# EAGLE design Goldfish-Voiceboard-based on fishr3 (EAGLE 6.5.0)
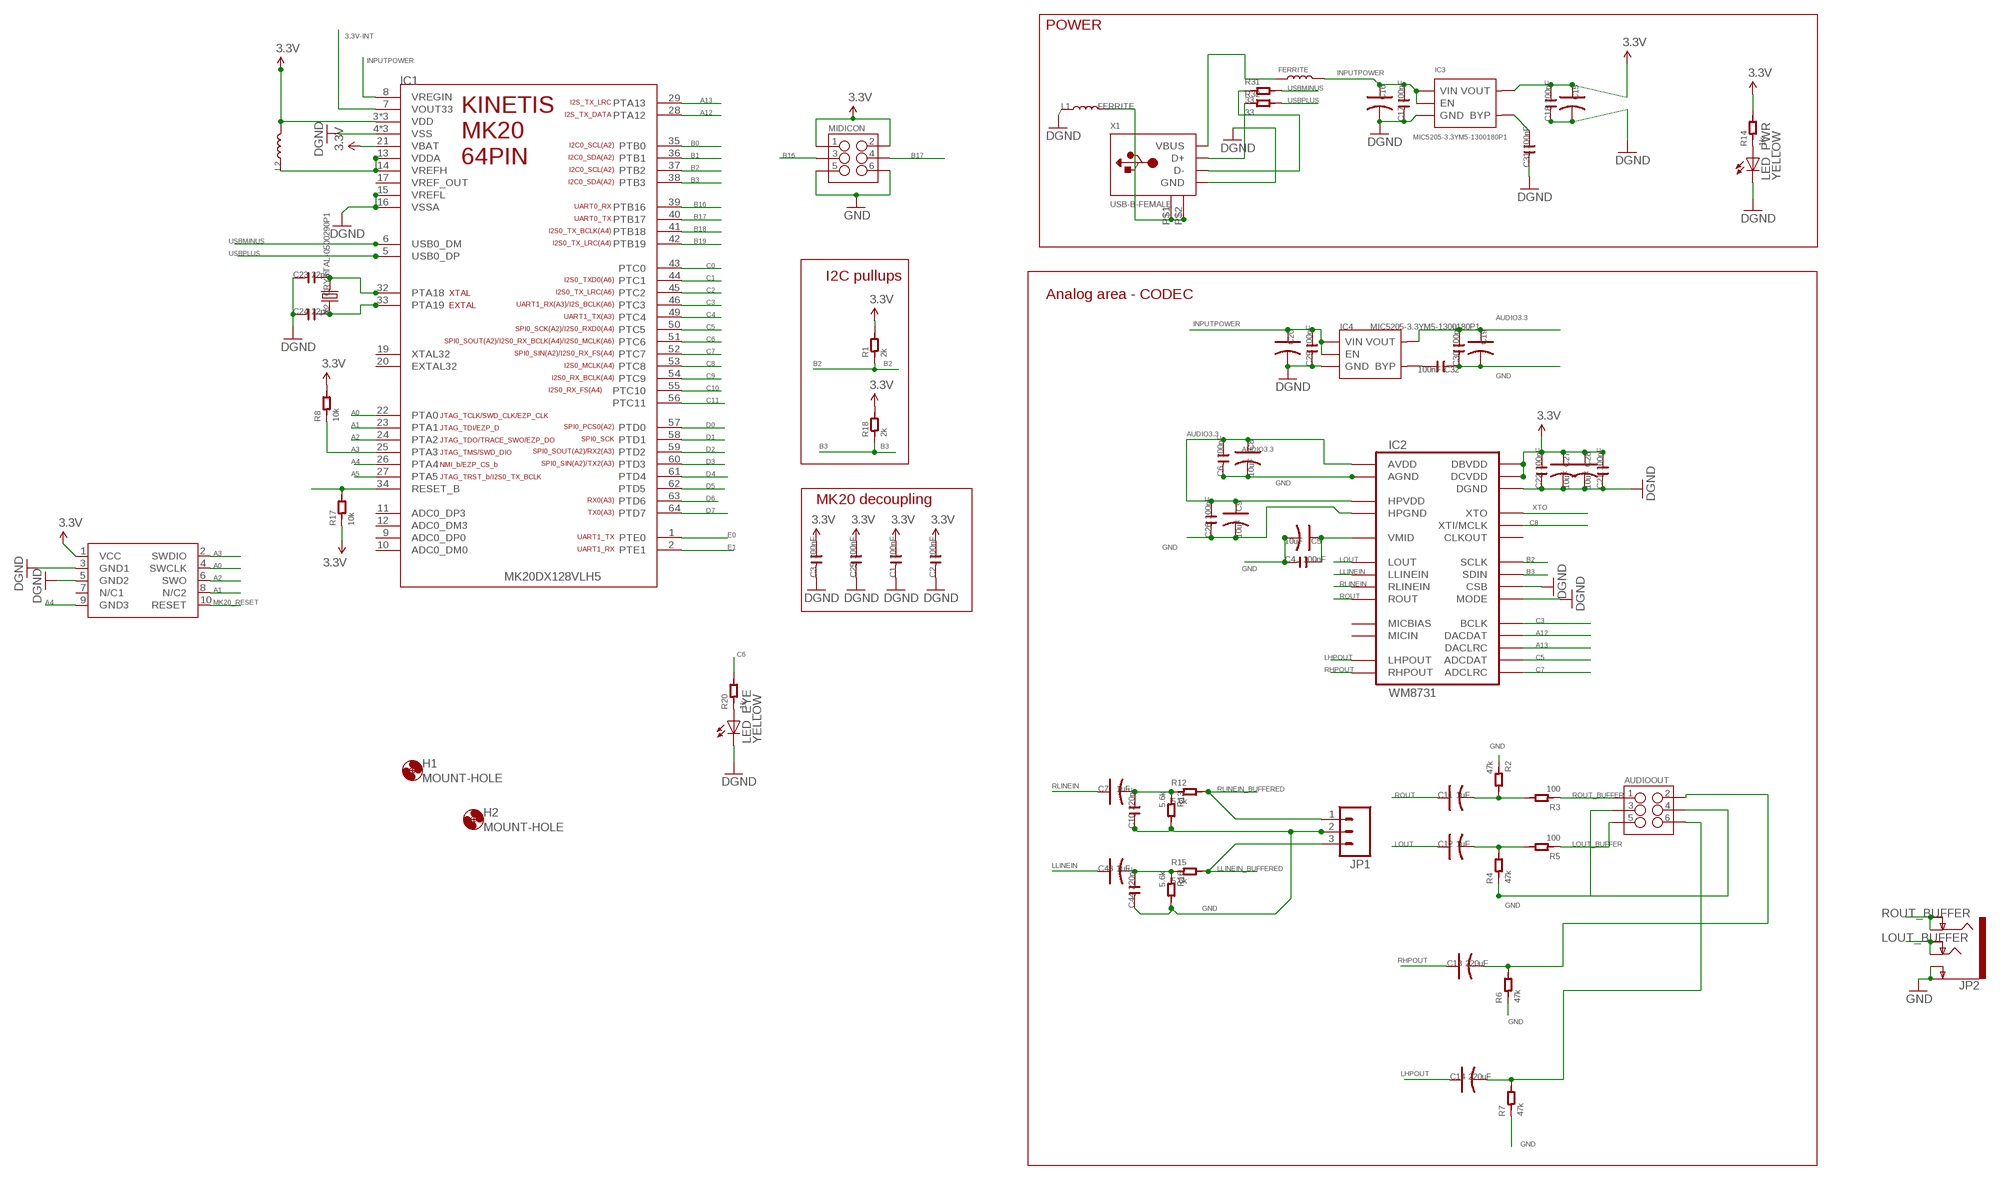
[diagram p0: schematic, sheet 1]

## Parts
AUDIOOUT  M03X2SMT  [2X3_SMT_POSTS]
C1  100nF  C-0603  [C0603]
C2  100nF  C-0603  [C0603]
C3  100nF  C-0603  [C0603]
C4  100nF  C-0603  [C0603]
C5  10uF  C-POLAR-A  [AVX-A]
C6  100nF  C-0603  [C0603]
C7  1uF  C-POLAR-A  [AVX-A]
C8  10uF  C-POLAR-A  [AVX-A]
C9  10uF  C-POLAR-A  [AVX-A]
C10  220nF  C-0603  [C0603]
C11  1uF  C-POLAR-A  [AVX-A]
C12  1uF  C-POLAR-A  [AVX-A]
C13  220uF  C-POLAR-B  [AVX-B]
C14  220uF  C-POLAR-B  [AVX-B]
C15  C-POLAR-A  [AVX-A]
C16  C-POLAR-A  [AVX-A]
C17  100nF  C-0603  [C0603]
C18  100nF  C-0603  [C0603]
C19  C-POLAR-A  [AVX-A]
C20  C-POLAR-A  [AVX-A]
C21  100nF  C-0603  [C0603]
C22  100nF  C-0603  [C0603]
C23  22pF  C-0603  [C0603]
C24  22pF  C-0603  [C0603]
C25  100nF  C-0603  [C0603]
C26  100nF  C-0603  [C0603]
C27  10uF  C-POLAR-A  [AVX-A]
C28  10uF  C-POLAR-A  [AVX-A]
C29  100nF  C-0603  [C0603]
C30  100nF  C-0603  [C0603]
C31  100nF  C-0603  [C0603]
C32  100nF  C-0603  [C0603]
C43  1uF  C-POLAR-A  [AVX-A]
C44  220nF  C-0603  [C0603]
H1  MOUNT-HOLE  [3.2-NOMARKINGS-SMALLSAFEZONE]
H2  MOUNT-HOLE  [3.2-NOMARKINGS-SMALLSAFEZONE]
IC1  MK20DX128VLH5  [MK20DX128VLH5]
IC2  WM8731  [28-SSOP]
IC3  MIC5205-3.3YM5-1300180P1  [SOT23-5]
IC4  MIC5205-3.3YM5-1300180P1  [SOT23-5]
JP1  M03PTH  [1X03]
JP2  AUDIO-JACK4-.25-HORIZ-TRS  [AUDIO-JACK-.25-INCH-HORIZ-PTH]
L1  FERRITE  L-0603  [L0603]
L2  L-0603  [L0603]
L4  FERRITE  L-0603  [L0603]
LED_EYE  YELLOW  LEDCHIP-LED0603  [CHIP-LED0603]
LED_PWR  YELLOW  LEDCHIP-LED0603  [CHIP-LED0603]
MIDICON  M03X2SMT  [2X3_SMT_POSTS]
R1  2k  R-0603  [R0603]
R2  47k  R-0603  [R0603]
R3  100  R-0603  [R0603]
R4  47k  R-0603  [R0603]
R5  100  R-0603  [R0603]
R6  47k  R-0603  [R0603]
R7  47k  R-0603  [R0603]
R8  10k  R-0603  [R0603]
R12  5.6k  R-0603  [R0603]
R13  5.6k  R-0603  [R0603]
R14  1k  R-0603  [R0603]
R15  5.6k  R-0603  [R0603]
R16  5.6k  R-0603  [R0603]
R17  10k  R-0603  [R0603]
R18  2k  R-0603  [R0603]
R20  1k  R-0603  [R0603]
R31  33  R-0603  [R0603]
R32  33  R-0603  [R0603]
SWD1  CORTEX_SWD  [M50-3600542]
X1  USB-B-FEMALE  [FCI61729]
X2  CRYSTAL-0500290P1  [2P-SMD-5.0X3.2]

## Nets
3.3V: C1.2 C2.2 C3.2 C15.+ C18.2 C21.2 C22.2 C25.2 C27.+ C28.+ IC1.3(VDD) IC1.21(VBAT) IC1.30(VDD) IC1.48(VDD) IC2.P$1(DBVDD) IC2.P$27(DCVDD) IC3.5(VOUT) L2.2 MIDICON.1 MIDICON.2 R1.2 R8.2 R14.2 R17.1 R18.2 SWD1.1(VCC)
3.3V-INT: IC1.7(VOUT33)
A0: IC1.22(PTA0) SWD1.4(SWCLK)
A1: IC1.23(PTA1) SWD1.8(N/C2)
A2: IC1.24(PTA2) SWD1.6(SWO)
A3: IC1.25(PTA3) R8.1 SWD1.2(SWDIO)
A4: IC1.26(PTA4) SWD1.9(GND3)
A5: IC1.27(PTA5)
A12: IC1.28(PTA12) IC2.P$4(DACDAT)
A13: IC1.29(PTA13) IC2.P$5(DACLRC)
AUDIO3.3 [GND]: C6.2 C8.+ C9.+ C19.+ C26.2 C30.2 IC2.P$8(HPVDD) IC2.P$14(AVDD) IC4.5(VOUT)
B0: IC1.35(PTB0)
B1: IC1.36(PTB1)
B2: IC1.37(PTB2) IC2.P$24(SCLK) R1.1
B3: IC1.38(PTB3) IC2.P$23(SDIN) R18.1
B16: IC1.39(PTB16) MIDICON.3
B17: IC1.40(PTB17) MIDICON.4
B18: IC1.41(PTB18)
B19: IC1.42(PTB19)
C0: IC1.43(PTC0)
C1: IC1.44(PTC1)
C2: IC1.45(PTC2)
C3: IC1.46(PTC3) IC2.P$3(BCLK)
C4: IC1.49(PTC4)
C5: IC1.50(PTC5) IC2.P$6(ADCDAT)
C6: IC1.51(PTC6) R20.2
C7: IC1.52(PTC7) IC2.P$7(ADCLRC)
C8: IC1.53(PTC8) IC2.P$25(XTI/MCLK)
C9: IC1.54(PTC9)
C10: IC1.55(PTC10)
C11: IC1.56(PTC11)
D0: IC1.57(PTD0)
D1: IC1.58(PTD1)
D2: IC1.59(PTD2)
D3: IC1.60(PTD3)
D4: IC1.61(PTD4)
D5: IC1.62(PTD5)
D6: IC1.63(PTD6)
D7: IC1.64(PTD7)
E0: IC1.1(PTE0)
E1: IC1.2(PTE1)
GND: AUDIOOUT.3 AUDIOOUT.4 C1.1 C2.1 C3.1 C4.1 C5.- C6.1 C8.- C9.- C10.1 C15.- C16.- C17.1 C18.1 C19.- C20.- C21.1 C22.1 C23.1 C24.1 C25.1 C26.1 C27.- C28.- C29.1 C30.1 C31.1 C32.1 C44.1 IC1.4(VSS) IC1.15(VREFL) IC1.16(VSSA) IC1.31(VSS) IC1.47(VSS) IC2.P$11(HPGND) IC2.P$15(AGND) IC2.P$21(MODE) IC2.P$22(CSB) IC2.P$28(DGND) IC3.2(GND) IC4.2(GND) JP1.2 JP2.P$2(EARTH) JP2.P$3(EARTH-NORM) L1.1 LED_EYE.C LED_PWR.C MIDICON.5 MIDICON.6 R2.1 R4.1 R6.1 R7.1 R13.2 R16.2 SWD1.3(GND1) SWD1.5(GND2) X1.4(GND) ; supply symbol labelled DGND
INPUTPOWER: C16.+ C17.2 C20.+ C29.2 IC1.8(VREGIN) IC3.1(VIN) IC3.3(EN) IC4.1(VIN) IC4.3(EN) L4.2
LHPOUT [MEDIUMAUDIO]: C14.+ IC2.P$9(LHPOUT)
LHPOUT_BUFFER [MEDIUMAUDIO]: AUDIOOUT.6 C14.- R7.2
LLINEIN [MEDIUMAUDIO]: C43.+ IC2.P$20(LLINEIN)
LLINEIN_BUFFERED [MEDIUMAUDIO]: JP1.3 R15.2
LOUT [MEDIUMAUDIO]: C12.+ IC2.P$12(LOUT)
LOUT_BUFFER [MEDIUMAUDIO]: AUDIOOUT.5 JP2.P$6(TIP) JP2.P$7(TIP-NORM) R5.1
MK20_RESET: IC1.34(RESET_B) R17.2 SWD1.10(RESET)
N$1: L4.1 X1.1(VBUS)
N$2: LED_PWR.A R14.1
N$3: L1.2 X1.P$1(GND1) X1.P$2(GND2)
N$9: C23.2 IC1.32(PTA18) X2.2
N$10: C24.2 IC1.33(PTA19) X2.1
N$12: C31.2 IC3.4(BYP)
N$13: C32.2 IC4.4(BYP)
N$17: LED_EYE.A R20.1
N$33: IC1.13(VDDA) IC1.14(VREFH) L2.1
N$41 [MEDIUMAUDIO]: C11.- R2.2 R3.2
N$43 [MEDIUMAUDIO]: C43.- C44.2 R15.1 R16.1
N$44 [MEDIUMAUDIO]: C7.- C10.2 R12.1 R13.1
N$46 [MEDIUMAUDIO]: C12.- R4.2 R5.2
N$65: C4.2 C5.+ IC2.P$16(VMID)
RHPOUT [MEDIUMAUDIO]: C13.+ IC2.P$10(RHPOUT)
RHPOUT_BUFFER [MEDIUMAUDIO]: AUDIOOUT.2 C13.- R6.2
RLINEIN [MEDIUMAUDIO]: C7.+ IC2.P$19(RLINEIN)
RLINEIN_BUFFERED [MEDIUMAUDIO]: JP1.1 R12.2
ROUT [MEDIUMAUDIO]: C11.+ IC2.P$13(ROUT)
ROUT_BUFFER [MEDIUMAUDIO]: AUDIOOUT.1 JP2.P$4(RING) JP2.P$5(RING-NORM) R3.1
USB_N: R32.1 X1.3(D+)
USB_P: R31.1 X1.2(D-)
USBMINUS: IC1.6(USB0_DM) R31.2
USBPLUS: IC1.5(USB0_DP) R32.2
XTO: IC2.P$26(XTO)
Unconnected: IC1.9(ADC0_DP0) IC1.10(ADC0_DM0) IC1.11(ADC0_DP3) IC1.12(ADC0_DM3) IC1.17(VREF_OUT) IC1.19(XTAL32) IC1.20(EXTAL32) IC2.P$2(CLKOUT) IC2.P$17(MICBIAS) IC2.P$18(MICIN) SWD1.7(N/C1)

## Notes on the sheet
- POWER
- I2C pullups
- Analog area - CODEC
- MK20 decoupling

## Library data of the parts
AUDIOOUT MIDICON = zephod-components:M03X2: 2x3 .1" header. Shrouded, with keying- CONN-10681 SMT- CONN-11415 Pogo pins- HW-11044; PROD_ID: CONN-11415
C1-C4 C6 C10 C17 C18 C21-C26 C29-C32 C44 = OPL Eagle Library:C*
C5 C7-C9 C11-C16 C19 C20 C27 C28 C43 = OPL Eagle Library:C-POLAR*
H1 H2 = zephod-components:MOUNT-HOLE: MOUNTING HOLE with drill center marker
IC1 = zephod-components:MK20DX128VLH5: Teensy 3.0 Processing Unit - MK20DX128VLH5 ARM Cortex M0 Datasheet: http://cache.freescale.com/files/32bit/doc/data_sheet/K20P64M50SF0.pdf
IC2 = microdecv1:WM8731
IC3 IC4 = OPL Eagle Library:MIC5205-3.3YM5: The MIC5205 is an efficient linear voltage regulator with ultra-low-noise output, very low dropout voltage (typically 17mV at light loads and 165mV at 150mA), and very low ground current (600µA at 100mA output). The MIC5205 offers better than 1% initial accuracy. datasheet here: http://www.micrel.com/product-info/prod/5205.shtml
JP1 = SparkFun-Connectors:M03: Header 3 Standard 3-pin 0.1" header. Use with straight break away headers (SKU : PRT-00116), right angle break away headers (PRT-00553), swiss pins (PRT-00743), machine pins (PRT-00117), and female headers (PRT-00115). Molex polarized connector foot print use with SKU : PRT-08232 with associated crimp pins and housings.
JP2 = SparkFun-Connectors:AUDIO-JACK4-.25-HORIZ-TRS: 1/4" TRS jack, horizontal Production SKU: COM-11144 Footprint unproven - datasheet and part seem to be slightly different; PROD_ID: COM-11144
L1 L2 L4 = OPL Eagle Library:L*
LED_EYE LED_PWR = adafruit:LED: LED OSRAM: - CHIPLED LG R971, LG N971, LY N971, LG Q971, LY Q971, LO R971, LY R971 LH N974, LH R974 LS Q976, LO Q976, LY Q976 LO Q996 - Hyper CHIPLED LW Q18S LB Q993, LB Q99A, LB R99A - SideLED LS A670, LO A670, LY A670, LG A670, LP A670 LB A673, LV A673, LT A673, LW A673 LH A674 LY A675 LS A676, LA A676, LO A676, LY A676, LW A676 LS A679, LY A679, LG A679 - Hyper Micro SIDELED® LS Y876, LA Y876, LO Y876, LY Y876 LT Y87S - SmartLED LW L88C, LW L88S LB L89C, LB L89S, LG L890 LS L89K, LO L89K, LY L89K LS L896, LA L896, LO L896, LY L896 - TOPLED LS T670, LO T670, LY T670, LG T670, LP T670 LSG T670, LSP T670, LSY T670, LOP T670, LYG T670 LG T671, LOG T671, LSG T671 LB T673, LV T673, LT T673, LW T673 LH T674 LS T676, LA T676, LO T676, LY T676, LB T676, LH T676, LSB T676, LW T676 LB T67C, LV T67C, LT T67C, LS T67K, LO T67K, LY T67K, LW E67C LS E67B, LA E67B, LO E67B, LY E67B, LB E67C, LV E67C, LT E67C LW T67C LS T679, LY T679, LG T679 LS T770, LO T770, LY T770, LG T770, LP T770 LB T773, LV T773, LT T773, LW T773 LH T774 LS E675, LA E675, LY E675, LS T675 LS T776, LA T776, LO T776, LY T776, LB T776 LHGB T686 LT T68C, LB T68C - Hyper Mini TOPLED® LB M676 - Mini TOPLED Santana® LG M470 LS M47K, LO M47K, LY M47K Source: http://www.osram.convergy.de/
R1 R18 = OPL:R*
R2-R8 R12-R17 R20 R31 R32 = OPL Eagle Library:R*
SWD1 = carrilib with jtags:CORTEX_SWD: .05" Cortex M Connector in SWD mode Manufacturer: Generic Part Number: Cortex M SWD Notes: I use Harwin M50-3600542 connectors
X1 = ld-components:USB-B-FEMALE: USB type B receptacle FCI 61729-59796
X2 = OPL Eagle Library:CRYSTAL*

## Net classes
0 default: width 0.178 mm, drill 0.102 mm
1 GND: width 0.229 mm
2 BIGAUDIO: width 1.016 mm
3 MEDIUMAUDIO: width 0.381 mm

## Board
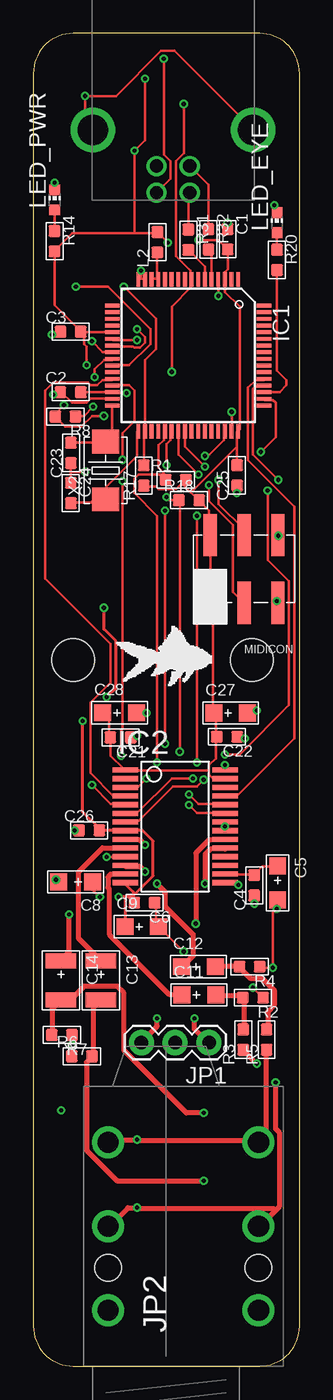
[diagram p1: board, top side]
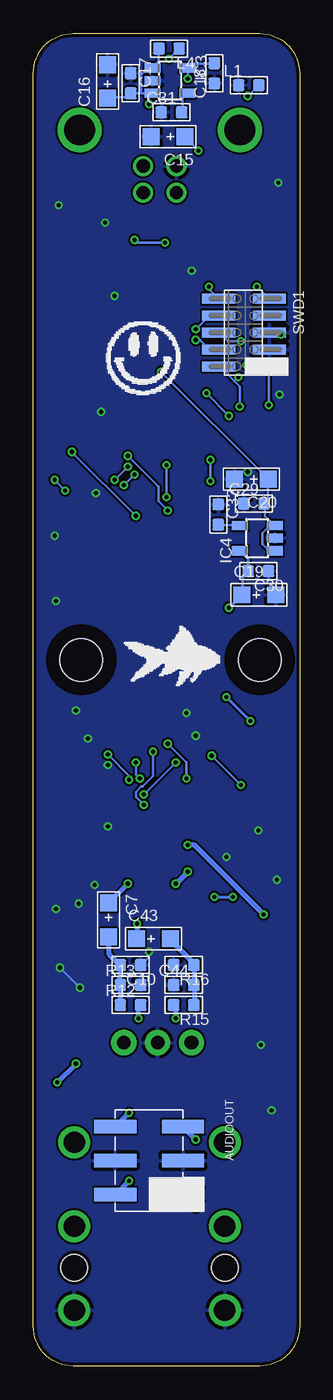
[diagram p2: board, bottom side, seen from below]

Size 20 x 100 mm. Coordinates in mm from the lower left corner, seen from the top.
Outline: 20,3 20,97 arc90 17,100 3,100 arc90 0,97 0,3 arc90 3,0 17,0 arc90 20,3
Copper layers (1*16): Top 0.035mm / dielectric 1.5mm / Bottom 0.035mm
Design rules "ITEADstudio_DRC": minimum track width 6mil, minimum drill 12mil, track to track 6mil, track to pad 6mil, pad to pad 6mil, via to via 6mil, smd to smd 0mil, copper to edge 10mil, drill to drill 10mil, minimum pad ring 10mil, minimum via ring 6mil, stop-mask expansion 2mil, vias tented up to drill 100mil, thermal gap 10mil
tRestrict: area 41.9,18.8 to 48.5,18.9

### Footprints (pad centres in the part's own frame; a part is rotated, then mirrored left to right if it is on the bottom)
2X3_SMT_POSTS = smd 1 x 3.17: 1 -2.54,-2.54; 2 -2.54,2.54; 3 0,-2.54; 4 0,2.54; 5 2.54,-2.54; 6 2.54,2.54
C0603 = smd 0.889 x 0.889: 1 -0.762,0; 2 0.762,0
AVX-A = smd 1.27 x 1.27: + -1.27,0; - 1.27,0
AVX-B = smd 1.143 x 2.286: + -1.46,0; - 1.46,0
3.2-NOMARKINGS-SMALLSAFEZONE = hole 3.2: 0,0
MK20DX128VLH5 = smd 1.1 x 0.285: 1 -5.605,3.385; 2 -5.605,2.885; 3 -5.605,2.385; 4 -5.605,1.885; 5 -5.605,1.385; 6 -5.605,0.885; 7 -5.605,0.385; 8 -5.605,-0.115; 9 -5.605,-0.615; 10 -5.605,-1.115; 11 -5.605,-1.615; 12 -5.605,-2.115; 13 -5.605,-2.615; 14 -5.605,-3.115; 15 -5.605,-3.615; 16 -5.605,-4.115; 33 5.795,-4.115; 34 5.795,-3.615; 35 5.795,-3.115; 36 5.795,-2.615; 37 5.795,-2.115; 38 5.795,-1.615; 39 5.795,-1.115; 40 5.795,-0.615; 41 5.795,-0.115; 42 5.795,0.385; 43 5.795,0.885; 44 5.795,1.385; 45 5.795,1.885; 46 5.795,2.385; 47 5.795,2.885; 48 5.795,3.385 | smd 0.285 x 1.1: 17 -3.655,-6.065; 18 -3.155,-6.065; 19 -2.655,-6.065; 20 -2.155,-6.065; 21 -1.655,-6.065; 22 -1.155,-6.065; 23 -0.655,-6.065; 24 -0.155,-6.065; 25 0.345,-6.065; 26 0.845,-6.065; 27 1.345,-6.065; 28 1.845,-6.065; 29 2.345,-6.065; 30 2.845,-6.065; 31 3.345,-6.065; 32 3.845,-6.065; 49 3.845,5.335; 50 3.345,5.335; 51 2.845,5.335; 52 2.345,5.335; 53 1.845,5.335; 54 1.345,5.335; 55 0.845,5.335; 56 0.345,5.335; 57 -0.155,5.335; 58 -0.655,5.335; 59 -1.155,5.335; 60 -1.655,5.335; 61 -2.155,5.335; 62 -2.655,5.335; 63 -3.155,5.335; 64 -3.655,5.335
28-SSOP = smd 0.381 x 1.905: P$1 -4.55,-3.752; P$2 -3.9,-3.752; P$3 -3.25,-3.752; P$4 -2.6,-3.752; P$5 -1.95,-3.752; P$6 -1.3,-3.752; P$7 -0.65,-3.752; P$8 0,-3.752; P$9 0.65,-3.752; P$10 1.3,-3.752; P$11 1.95,-3.752; P$12 2.6,-3.752; P$13 3.25,-3.752; P$14 3.9,-3.752; P$15 3.9,3.752; P$16 3.25,3.752; P$17 2.6,3.752; P$18 1.95,3.752; P$19 1.3,3.752; P$20 0.65,3.752; P$21 0,3.752; P$22 -0.65,3.752; P$23 -1.3,3.752; P$24 -1.95,3.752; P$25 -2.6,3.752; P$26 -3.25,3.752; P$27 -3.9,3.752; P$28 -4.55,3.752
SOT23-5 = smd 0.69 x 1.2: 1 -0.95,-1.3; 2 0,-1.3; 3 0.95,-1.3; 4 0.95,1.3; 5 -0.95,1.3
1X03 = drill 1.016 pad 1.88: 1 0,0; 2 2.54,0; 3 5.08,0
AUDIO-JACK-.25-INCH-HORIZ-PTH = drill 1.6: P$2 4.2,-6.92; P$3 4.2,4.38; P$4 10.5,-6.92; P$5 10.5,4.38; P$6 16.8,-6.92; P$7 16.8,4.38 | hole 2: 7.4,4.38; 7.4,-6.92
L0603 = smd 0.889 x 0.889: 1 -0.762,0; 2 0.762,0
CHIP-LED0603 = smd 0.8 x 0.8: A 0,-0.75; C 0,0.75
R0603 = smd 0.889 x 0.889: 1 -0.762,0; 2 0.762,0
M50-3600542 = smd 0.75 x 2.5: 1 -2.54,-1.81; 2 -2.54,2; 3 -1.27,-1.81; 4 -1.27,2; 5 0,-1.81; 6 0,2; 7 1.27,-1.81; 8 1.27,2; 9 2.54,-1.81; 10 2.54,2
FCI61729 = drill 1: 1 1.25,4.71; 2 -1.25,4.71; 3 -1.25,2.71; 4 1.25,2.71 | drill 2.3: P$1 -6.02,0; P$2 6.02,0
2P-SMD-5.0X3.2 = smd 1.778 x 2.032: 1 -2.159,0; 2 2.159,0

### Placement (x,y rotation side)
AUDIOOUT  11.3,15.43 90 bottom
C1  14.6,84.55 270 top
C2  2.8,73.08 0 top
C3  2.81,77.61 0 top
C4  16.6,36.08 90 top
C5  18.35,36.25 270 top
C6  8.35,34.77 180 top
C7  14.35,33.48 270 bottom
C8  3.17,36.33 180 top
C9  8.15,32.98 0 top
C10  12.7,30.1 180 bottom
C11  12.45,27.85 0 top
C12  12.4,29.98 0 top
C13  5.08,28.95 270 top
C14  2.08,28.95 270 top
C15  9.88,92.25 180 bottom
C16  14.43,96.39 90 bottom
C17  12.68,96.25 270 bottom
C18  6.4,97 90 bottom
C19  3.05,57.88 0 bottom
C20  3.62,66.55 180 bottom
C21  6.55,47.17 180 top
C22  14.55,47.23 180 top
C23  2.83,68.52 90 top
C24  2.82,65.51 270 top
C25  15.31,66.83 90 top
C26  4.2,40.2 0 top
C27  14.82,49 0 top
C28  6.47,49.02 0 top
C29  3.42,64.72 0 bottom
C30  3.1,59.65 180 bottom
C31  9.62,94.08 0 bottom
C32  6.1,63.9 270 bottom
C43  10.97,32.08 0 bottom
C44  8.7,28.6 0 bottom
H1  16.4,53 0 top
H2  3,53 0 top
IC1  12,75.92 270 top
IC2  10.65,40.17 270 top
IC3  9.73,96.45 270 bottom
IC4  3.17,62.12 90 bottom
JP1  13.2,24.27 180 top
JP2  10,0 90 top
L1  3.81,96.11 0 bottom
L2  9.32,84.33 90 top
L4  9.8,98.85 180 bottom
LED_EYE  18.3,85.8 0 top
LED_PWR  1.6,87.5 0 top
MIDICON  15.82,59.83 0 top
R1  10.7,66.5 0 top
R2  16.5,27.65 180 top
R3  15.78,24.5 90 top
R4  16.25,29.98 180 top
R5  17.52,24.5 90 top
R6  3.65,23.25 0 top
R7  2.15,24.85 180 top
R8  2.41,71.26 180 top
R12  12.7,27.1 0 bottom
R13  12.7,28.6 0 bottom
R14  1.6,84.4 270 top
R15  8.7,27.1 180 bottom
R16  8.7,30.1 180 bottom
R17  8.3,66.83 90 top
R18  11.7,64.97 0 top
R20  18.3,83 270 top
R31  11.64,84.52 270 top
R32  13.16,84.54 270 top
SWD1  4.08,77.55 90 bottom
U$1  [FISH_SMALL]  11.6,53.1 0 top
U$2  [ACIDSMILE]  11.7,75.7 0 bottom
U$3  [FISH_SMALL]  7.8,53.1 0 bottom
X1  10.5,92.75 180 top
X2  5.43,67.2 90 top

### Tracks (layer width: path | path; a pad name or v marks a point on that pad's centre or on a via)
3.3V  (via drill 0.3)
  Top 0.178: C2.2 3.6,73.1 5.9,73.1 IC1.30 6,73 v7,73 | v2.3,72.1 1.7,71.5 1.7,71.3 R8.2 1.7,71.2 2.4,70.5 3.6,70.5 4.4,71.3 v5.3,71.3 | 3.8,77.6 5.9,77.6 IC1.21 | 3.8,77.6 3.6,77.6 C3.2 | C3.2 3.5,77.7 1.6,79.6 R14.2 1.6,83.7 2.9,85 7.6,85 | 7.6,85 9.3,85 L2.2 9.4,85 v10.1,84.3 | 7.6,85 v7.6,91.2 8.4,92 v8.4,96.6 | v4,75.1 4,76.5 3.8,76.7 3.8,77.6 | 3.8,77.6 C3.2 | 13.2,44.7 13.2,44.4 13.5,44.1 14.4,44.1 IC2.P$27 | 13.2,44.7 13.2,45.1 13.7,45.6 13.7,47.2 C22.2 13.7,47.3 13.7,48.9 13.6,49 C27.+ 13.5,49 13.5,57 13.3,57.2 MIDICON.1 13.3,62.3 MIDICON.2 13.2,62.4 13.2,64.2 12.5,64.9 R18.2 12.4,65 11.85,65.55 | C28.+ 5.3,49 5.7,48.6 5.7,47.2 C21.2 5.8,47.1 5.8,45.8 6.8,44.8 IC2.P$1 6.9,44.7 13.2,44.7 | R17.1 8.3,66 9.2,66 9.4,65.8 10.7,65.8 11.4,66.5 R1.2 11.2,66.2 11.85,65.55 | 15.3,69 15.3,70.1 IC1.48 15.4,70.2 15.5,70.3 15.5,79.5 14.4,80.6 14.4,81.5 IC1.3 14.4,81.6 14.4,82.1 14.6,82.3 C1.2 13.9,84.5 v12.4,84.5 | 15.3,69 C25.2 | 15.3,69 11.85,65.55
  Bottom 0.178: v2.3,72.1 2.3,75 SWD1.1 2.3,75.1 v4,75.1 | v5.3,71.3 v7,73 | C18.2 6.5,97.7 8.2,97.7 8.4,97.5 IC3.5 8.4,97.4 v8.4,96.6 | v7.6,91.2 8.6,92.2 C15.+ | v10.1,84.3 12.2,84.3 v12.4,84.5
A0  (via drill 0.3)
  Top 0.178: v7.8,77 6,77 IC1.22
  Bottom 0.178: v7.8,77 7.5,77 6.8,76.3 6.1,76.3 SWD1.4
A1  (via drill 0.3)
  Top 0.178: v7.8,77.8 8.4,77.2 8.4,76.8 8,76.4 7.6,76.4 7.5,76.5 6,76.5 IC1.23
  Bottom 0.178: v7.8,77.8 6.8,78.8 6.1,78.8 SWD1.8
A2  (via drill 0.3)
  Top 0.178: v4.4,76.9 5.2,76.1 5.9,76.1 IC1.24
  Bottom 0.178: v4.4,76.9 5.4,76.9 6,77.5 SWD1.6
A3  (via drill 0.3)
  Top 0.178: v4.5,72 3.8,71.3 3.2,71.3 R8.1 | v4.6,74.2 4.6,74.8 5.3,75.5 5.9,75.5 IC1.25
  Bottom 0.178: v4.5,72 4.5,73.5 4.9,73.9 | 4.9,73.9 6,75 SWD1.2 | 4.9,73.9 v4.6,74.2
A4  (via drill 0.3)
  Top 0.178: v3.2,81 5.6,81 8.8,77.8 8.8,76.7 7.2,75.1 6,75.1 IC1.26
  Bottom 0.178: v3.2,81 2.3,80.1 SWD1.9
A12
  Top 0.178: IC1.28 5.9,74 5.2,74 4.8,73.6 4.3,73.6 4.1,73.8 1.5,73.8 0.9,73.2 0.9,59.1 5.8,54.2 5.8,51.3 4.3,49.8 4.3,44.5 6,42.8 6.8,42.8 IC2.P$4
A13  (via drill 0.3)
  Top 0.178: v6.7,68 6.7,70 7.6,70.9 7.6,73.2 7.2,73.6 6,73.6 IC1.29 | v6.7,66.4 6.7,47.8 6.6,47.7 v6.6,45.8 | v4.4,43.6 5.8,42.2 6.8,42.2 IC2.P$5
  Bottom 0.178: v6.7,66.4 v6.7,68 | v4.4,43.6 v6.6,45.8
AUDIO3.3  (via drill 0.3)
  Top 0.229: 7.5,35.4 7.5,35.6 6.9,36.2 IC2.P$14 | 7.5,35.4 7.5,34.8 C6.2 7.4,35.2 6.9,35.2 | v5,35.2 4.5,35.7 4.5,36.3 C8.+ | 6.9,35.2 v6.4,35.2 | 6.9,35.2 6.9,33 C9.+ | 7.5,35.4 7.6,35.4 9,36.8 9,39.4 8.2,40.2 7,40.2 IC2.P$8 6.8,40.2 C26.2 5,40.3 3.7,41.6 v3.7,48.4 | v5.3,56.9 5.3,55.3 6.2,54.4 6.2,50.9 v5.5,50.2
  Bottom 0.229: IC4.5 4.4,61.1 3.9,60.6 3.9,59.7 C30.2 3.9,59.6 4.3,59.2 4.3,57.9 C19.+ 4.4,57.8 v5.3,56.9 | v6.4,35.2 v5,35.2 | v3.7,48.4 v5.5,50.2
B2  (via drill 0.3)
  Top 0.178: IC1.37 9.8,70.1 9.8,69.5 9.4,69.1 9.4,67.4 9.9,66.9 9.9,66.5 R1.1 9.8,66.9 7.9,66.9 7.6,66.6 7.6,65.5 9.3,63.8 v9.3,45.3 | v11.7,42.9 12.4,42.2 14.4,42.2 IC2.P$24
  Bottom 0.178: v9.3,45.3 v11.7,42.9
B3  (via drill 0.3)
  Top 0.178: v10,65.2 10.2,65 10.9,65 R18.1 11,64.9 v11,46.1 | v10,67.6 10,69.2 10.3,69.5 10.3,70.1 IC1.38 | v11.7,42.1 12.3,41.5 14.4,41.5 IC2.P$23
  Bottom 0.178: v10,67.6 v10,65.2 | v11.7,42.1 12.3,42.7 12.3,43.1 11.9,43.5 11.8,43.5 11,44.3 v11,46.1
B16  (via drill 0.3)
  Top 0.178: v12.4,66.9 10.9,68.4 10.9,70.1 IC1.39 | v13.2,66.1 13.2,64.9 15,63.1 15,58.1 15.8,57.3 MIDICON.3
  Bottom 0.178: v13.2,66.1 v12.4,66.9
B17  (via drill 0.3)
  Top 0.178: v12.9,67.5 11.4,69 11.4,70.1 IC1.40 | v13.9,66.5 13.9,64.7 15.8,62.8 15.8,62.4 MIDICON.4
  Bottom 0.178: v13.9,66.5 v12.9,67.5
C3  (via drill 0.3)
  Top 0.178: v12.9,68.3 13.1,68.3 14.3,69.5 14.3,70.1 IC1.46 | v9.9,46.7 v9.9,64.2 | v8.5,44.1 7.9,43.5 6.9,43.5 IC2.P$3
  Bottom 0.178: v12.9,68.3 10.6,66 10.6,64.9 v9.9,64.2 | v9.9,46.7 8.5,45.3 v8.5,44.1
C5  (via drill 0.3)
  Top 0.178: v17.1,68.6 18.2,69.7 18.2,72.3 18,72.5 17.4,72.5 IC1.50 | v12.3,45.3 v12.3,63.8 | v12,44.1 10.4,44.1 7.8,41.5 6.9,41.5 IC2.P$6
  Bottom 0.178: v12.3,63.8 v17.1,68.6 | v12.3,45.3 12.3,44.4 v12,44.1
C6
  Top 0.178: R20.2 18.3,74.7 19,74 19,73.6 18.5,73.1 17.4,73.1 IC1.51
C7  (via drill 0.3)
  Top 0.178: v18.4,66.5 16.5,68.4 16.5,73.3 16.7,73.5 17.3,73.5 IC1.52 | v17.6,65.7 17.6,60.5 19.2,58.9 19.2,49.6 15.5,45.9 v14.4,45.9 | v12.8,44 12.3,43.5 10.5,43.5 7.9,40.9 6.9,40.9 IC2.P$7
  Bottom 0.178: v17.6,65.7 v18.4,66.5 | v14.4,45.9 12.8,44.3 v12.8,44
C8
  Top 0.178: IC1.53 17.3,74 16.7,74 16.1,73.4 16.1,68 19.6,64.5 19.6,47.1 15.3,42.8 14.5,42.8 IC2.P$25
GND  (via drill 0.3)
  Top 0.178: v16.5,28.4 17.2,27.7 R2.1 | R4.1 17.1,29.9 v18,29.9 18,34 v18.3,34.3 18.3,34.9 C5.- | 14.4,36.3 IC2.P$15 14.5,36.2 15.3,36.2 v15.4,36.1 | C6.1 9.2,34.7 9.2,33.2 9.4,33 C9.- 9.5,32.9 v11.3,31.1 | 2.8,67.1 2.8,67.7 C23.1 | 2.8,67.1 2.8,66.3 C24.1 | 8.1,81.6 8.3,81.6 IC1.15 | 8.1,81.6 7.9,81.6 IC1.16 | v1.4,77.4 1.8,77.4 2,77.6 C3.1 | v1.6,88.8 LED_PWR.C | LED_EYE.C 18.3,86.9 v18.1,87.1 | R6.1 2.9,23.3 v2.9,24.1 2.9,24.8 R7.1 | v3.1,40.2 C26.1 | v7.8,47.3 7.7,47.2 7.4,47.2 C21.1 | v15.9,47.1 15.8,47.2 15.4,47.2 C22.1 | v1.5,72.9 1.6,73 2,73 C2.1 2.1,73.1 2.9,72.3 4,72.3 4.3,72.6 5.9,72.6 IC1.31 | v15.3,65.5 15.3,66 C25.1 | v14.6,85.8 C1.1 | v16.6,34.7 C4.1 | v14.9,71.6 14.9,70.2 IC1.47 | v13.9,80.3 13.9,81.5 IC1.4 | v8.1,82.2 8.1,81.6 | v1.7,36.5 1.8,36.4 1.9,36.4 C8.- | v8.5,49 7.8,49 C28.- | C27.- 16.6,49 v16.8,49.2 | v3.9,67.1 2.8,67.1 | v5.5,38.2 6.8,38.2 IC2.P$11 | IC2.P$21 14.4,40.2 v14.4,40.5 14.4,40.8 IC2.P$22 | v14.4,45.1 14.4,44.8 IC2.P$28 | v18.3,57.4 18.3,57.3 MIDICON.5 | v18.4,62.3 MIDICON.6
  Bottom 0.178: v18,29.9 v16.5,28.4 | v1.4,77.4 2.1,77.4 2.2,77.5 SWD1.5 | v11.3,31.1 11.3,30.7 11.9,30.1 C10.1
  other vias: 2.1,19.2
  pour Bottom: 0,100 20,100 20,0 0,0
INPUTPOWER  (via drill 0.3)
  Top 0.178: v10.4,74.6 10.4,79.5 11.8,80.9 11.8,81.5 IC1.8 11.8,81.6 11.8,82.2 10.7,83.3 10.7,90.4 11.3,91 v11.3,94.7
  Bottom 0.178: IC4.1 1.9,61.2 2.3,61.2 2.8,61.7 2.8,62.5 2.1,63.2 IC4.3 1.9,63.1 2.6,63.8 2.6,64.7 C29.2 2.6,64.8 2.4,65 2.4,66.5 C20.+ 2.4,66.6 v10.4,74.6 | L4.2 10.6,98.8 10.6,97.9 11,97.5 IC3.1 11.1,97.4 11.4,97.4 11.9,96.9 11.9,95.5 | 11.3,95.5 11.1,95.5 IC3.3 11.3,95.5 | 11.3,95.5 11.9,95.5 | 11.9,95.5 12.6,95.5 C17.2 12.7,95.4 12.9,95.2 14.4,95.2 C16.+ | v11.3,94.7 11.3,95.5
LHPOUT  (via drill 0.3)
  Top 0.381: v8.4,39.1 8,39.5 6.9,39.5 IC2.P$9 | v2.7,33.9 2.7,31.1 2.1,30.5 C14.+
  Bottom 0.381: v8.4,39.1 7.9,39.1 v2.7,33.9
LHPOUT_BUFFER  (via drill 0.3)
  Top 0.381: R7.2 1.4,24.9 1.4,26.8 2,27.4 C14.- 2.2,27.6 2.9,27.6 3.8,28.5 6.3,28.5 6.8,28 6.8,23.7 11.5,19 v12.8,19
  Bottom 0.381: v12.8,19 13.8,18 AUDIOOUT.6
LLINEIN  (via drill 0.3)
  Top 0.381: v12.2,33.2 12.2,38.5 13.2,39.5 14.4,39.5 IC2.P$20
  Bottom 0.381: v12.2,33.2 12.2,32.1 C43.+
LLINEIN_BUFFERED  (via drill 0.3)
  Top 0.381: v9.3,26.1 9.3,25.5 8.1,24.3 JP1.3
  Bottom 0.381: 9.5,27.1 R15.2 9.3,27 v9.3,26.1
LOUT  (via drill 0.3)
  Top 0.381: v9.3,36.2 9.9,35.6 9.9,34.5 12,32.4 12,30.8 11.2,30 C12.+ | v8.4,37.1 8,37.5 6.9,37.5 IC2.P$12
  Bottom 0.381: v8.4,37.1 v9.3,36.2
LOUT_BUFFER  (via drill 0.3)
  Top 0.381: JP2.P$7 5.7,16.8 5.9,17 v7.8,17 7.9,16.9 16.8,16.9 JP2.P$6 17,16.8 17.5,17.3 17.5,23.7 R5.1
  Bottom 0.381: v7.8,17 8.7,17.9 AUDIOOUT.5
MK20_RESET  (via drill 0.3)
  Top 0.178: R17.2 8.3,70.1 IC1.34 8.4,70.2 8.4,75.5 9.2,76.3 9.2,78.6 v6.8,81
  Bottom 0.178: v6.8,81 6.8,80.8 6.1,80.1 SWD1.10
N$1  (via drill 0.3)
  Top 0.178: v9.8,98.1 9.8,90.9 10.3,90.4 10.3,89.1 9.3,88.1 X1.1
  Bottom 0.178: v9.8,98.1 9.1,98.8 L4.1
N$2
  Top 0.178: R14.1 LED_PWR.A
N$3  (via drill 0.3)
  Top 0.178: X1.P$2 4.4,92.8 3.9,93.3 v3.9,95.3 6.2,95.3 9.6,98.7 10.6,98.7 16.5,92.8 X1.P$1
  Bottom 0.178: v3.9,95.3 3.1,96.1 L1.2
N$9
  Top 0.178: C23.2 2.9,69.3 5.4,69.3 X2.2 5.5,69.4 5.9,69.8 5.9,72 IC1.32
N$10
  Top 0.178: 4.3,64.8 5.2,64.8 5.4,65 X2.1 | 4.3,64.8 2.9,64.8 C24.2 | 4.3,64.8 7.8,68.3 7.8,70.1 IC1.33
N$12
  Bottom 0.178: C31.2 8.8,94.1 8.8,95.2 8.5,95.5 IC3.4
N$13
  Bottom 0.178: C32.2 6.1,63.1 4.5,63.1 IC4.4
N$17
  Top 0.178: R20.1 LED_EYE.A
N$33
  Top 0.178: 9.3,81.6 9.3,83.5 L2.1 | 9.3,81.6 8.9,81.6 IC1.14 | 9.3,81.6 IC1.13
N$41
  Top 0.381: R3.2 15.8,25.3 15.8,27.6 R2.2 15.7,27.8 13.8,27.8 C11.-
N$43
  Bottom 0.381: R15.1 7.9,27.1 7.9,28.6 C44.2 7.9,28.7 7.9,30.1 R16.1 7.9,30.2 9.7,32 C43.-
N$44
  Bottom 0.381: R12.1 13.5,27.1 13.5,28.6 R13.1 13.5,28.7 13.5,30.1 C10.2 13.6,30.2 14.3,30.9 14.3,32.2 C7.-
N$46
  Top 0.381: R5.2 17.6,25.3 17.6,26.6 18.1,27.1 18.1,28.2 17.2,29.1 16.3,29.1 15.5,29.9 R4.2 15.3,30 13.7,30 C12.-
N$65
  Top 0.178: 16.6,36.9 14.5,36.9 IC2.P$16 | 16.6,36.9 17.2,37.5 18.3,37.5 C5.+ | 16.6,36.9 C4.2
RHPOUT
  Top 0.381: IC2.P$10 6.8,38.9 5.2,38.9 3.4,37.1 3.4,32.1 5,30.5 C13.+
RHPOUT_BUFFER  (via drill 0.3)
  Top 0.381: C13.- 5,27.4 4.5,26.9 4.5,23.3 R6.2 4.3,23.1 4,22.8 4,16.2 6.3,13.9 v12.8,13.9
  Bottom 0.381: v12.8,13.9 13.8,12.9 AUDIOOUT.2
RLINEIN  (via drill 0.3)
  Top 0.381: v12.9,36.2 12.9,38.4 13.3,38.8 14.4,38.8 IC2.P$19
  Bottom 0.381: v12.9,36.2 14.3,34.8 C7.+
RLINEIN_BUFFERED  (via drill 0.3)
  Top 0.381: v12.1,26.1 12.1,25.3 13.2,24.2 JP1.1
  Bottom 0.381: 11.9,27.1 R12.2 12.1,27 v12.1,26.1
ROUT
  Top 0.381: C11.+ 11.1,27.9 10.2,27.9 5.7,32.4 5.7,35.8 5.6,35.9 5.6,36.7 5.8,36.9 6.8,36.9 IC2.P$13
ROUT_BUFFER  (via drill 0.3)
  Top 0.381: JP2.P$5 5.7,10.5 7.1,11.9 v7.8,11.9 7.9,11.8 18.1,11.8 18.2,11.7 | v16.8,22.7 15.8,23.7 R3.1 | v18.2,21.3 18.2,17.8 18.5,17.5 18.5,12 18.2,11.7 | 18.2,11.7 17,10.5 JP2.P$4
  Bottom 0.381: v7.8,11.9 8.7,12.8 AUDIOOUT.1 | v18.2,21.3 v16.8,22.7
USB_N
  Top 0.178: R32.1 13.16,88.63 X1.3
USB_P
  Top 0.178: R31.1 11.64,87.94 X1.2
USBMINUS
  Top 0.178: IC1.6 12.89,82.51 R31.2
USBPLUS
  Top 0.178: IC1.5 13.39,83.55 R32.2